# Altium schematic sheet Schematic Ouvre_Porte.SchDoc
size A4
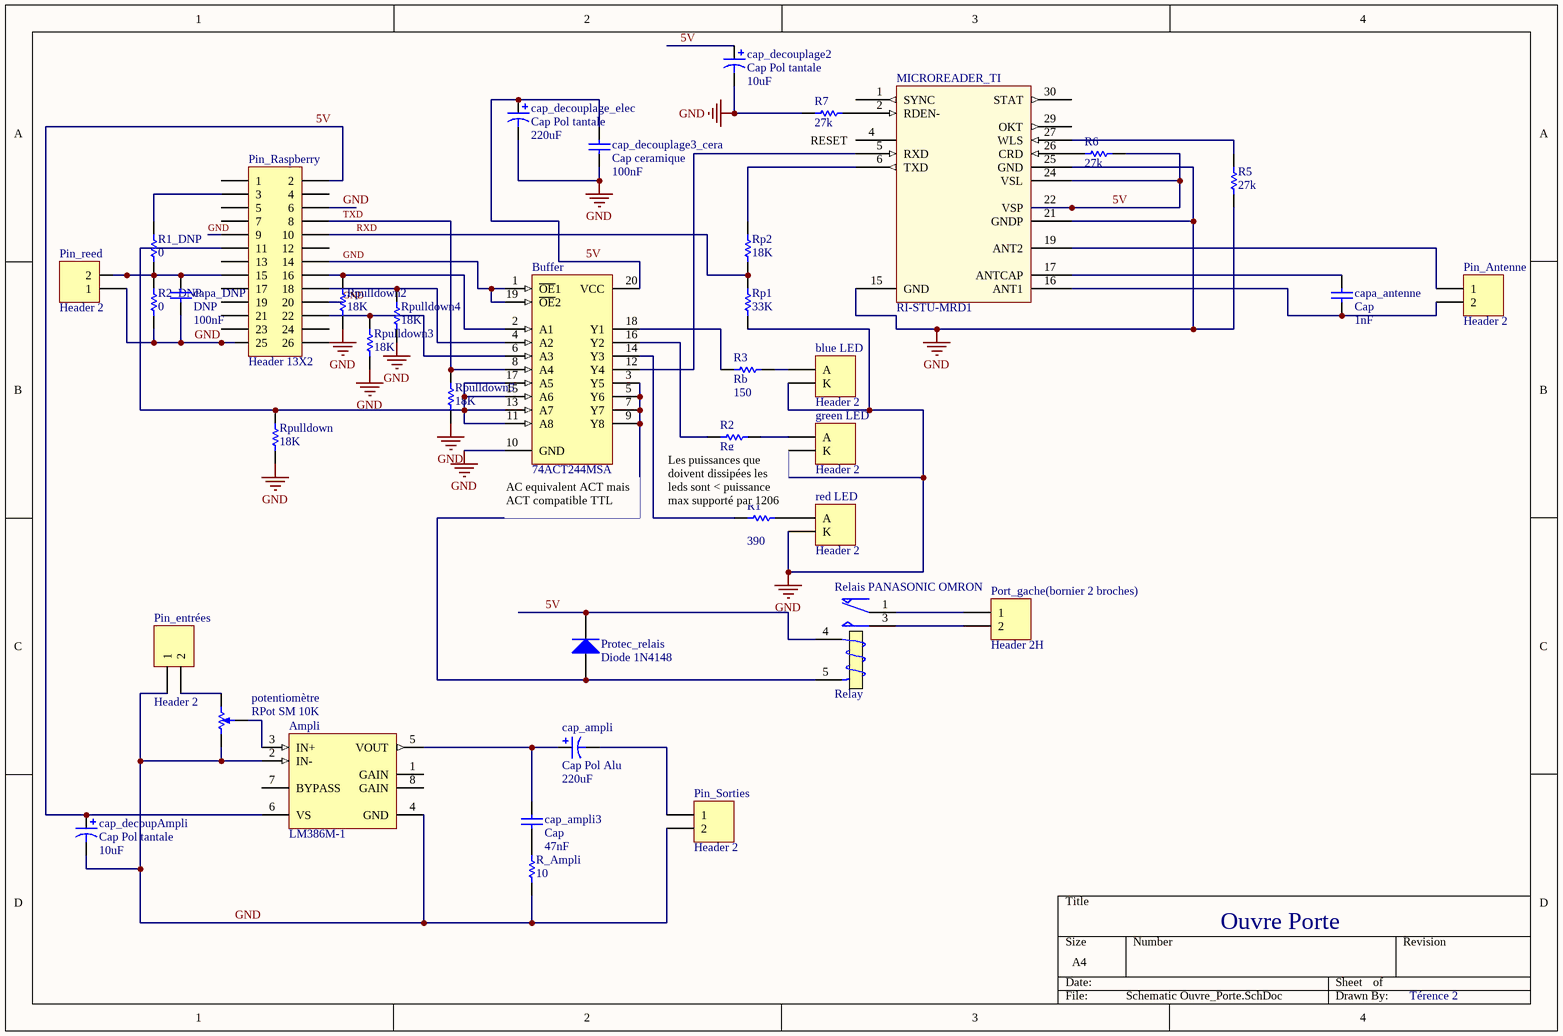
[diagram p0: Schematic Ouvre_Porte.SchDoc]

## Parts
Ampli  LM386M-1  [M08A_N]
blue_LED  Header 2  [HDR1X2]
Buffer  74ACT244MSA  [MSA20_L]
cap_ampli  Cap Pol Alu  value 220uF  [Capacitor D300]
cap_ampli3  Cap  value 47nF  [1206]
cap_decoupAmpli  Cap Pol tantale  value 10uF  [1206]
cap_decouplage2  Cap Pol tantale  value 10uF  [1206]
cap_decouplage3_cera  Cap ceramique  value 100nF  [1206]
cap_decouplage_elec  Cap Pol tantale  value 220uF  [Capacitor D300]
capa_antenne  Cap  value 1nF  [1206]
capa_DNP  DNP  value 100nF  [1206]
green_LED  Header 2  [HDR1X2]
MICROREADER_TI  RI-STU-MRD1  [DIP30]
Pin_Antenne  Header 2  [HDR1X2]
Pin_entrées  Header 2  [HDR1X2]
Pin_Raspberry  Header 13X2  [HDR2X13]
Pin_reed  Header 2  [HDR1X2]
Pin_Sorties  Header 2  [HDR1X2]
Port_gache(bornier_2_broches)  Header 2H  [2P_PCB_ScrewTerm_90S_3.81MM]
potentiomètre  RPot SM 10K  [POT4MM-2]
Protec_relais  Diode 1N4148  [1206]
R1  value 390  [8-1206]  (hidden comment: Rr)
R1_DNP  value 0  [8-1206]  (hidden comment: DNP)
R2  Rg  value 150  [8-1206]
R2_DNP  value 0  [8-1206]  (hidden comment: DNP)
R3  Rb  value 150  [8-1206]
R5  value 27k  [8-1206]  (hidden comment: Rr)
R6  value 27k  [8-1206]  (hidden comment: Rr)
R7  value 27k  [8-1206]  (hidden comment: Rr)
R_Ampli  value 10  [8-1206]  (hidden comment: Rr)
red_LED  Header 2  [HDR1X2]
Relais_PANASONIC_OMRON  Relay  [layout Relais]
Rp1  value 33K  [8-1206]
Rp2  value 18K  [8-1206]  (hidden comment: Rr)
Rpulldown  value 18K  [8-1206]
Rpulldown2  value 18K  [8-1206]
Rpulldown3  value 18K  [8-1206]
Rpulldown4  value 18K  [8-1206]
Rpulldown5  value 18K  [8-1206]

## Nets
GND: Ampli.2(IN-) Ampli.4(GND) blue_LED.2(K) Buffer.1(~{OE}1) Buffer.10(GND) Buffer.19(~{OE}2) cap_decoupAmpli.2 cap_decouplage2.2 cap_decouplage3_cera.2 cap_decouplage_elec.2 capa_DNP.2 green_LED.2(K) MICROREADER_TI.15(GND) MICROREADER_TI.21(GNDP) MICROREADER_TI.25(GND) Pin_entrées.1 Pin_Raspberry.6 Pin_Raspberry.9 Pin_Raspberry.14 Pin_Raspberry.20 Pin_Raspberry.25 Pin_reed.1 Pin_Sorties.2 potentiomètre.CCW(-) R2_DNP.1 R5.1 R7.2 R_Ampli.1 red_LED.2(K) Rp1.1 Rpulldown.1 Rpulldown2.1 Rpulldown3.1 Rpulldown4.1 Rpulldown5.1
5V: Ampli.6(VS) Buffer.20(VCC) cap_decoupAmpli.1 cap_decouplage2.1 cap_decouplage3_cera.1 cap_decouplage_elec.1 MICROREADER_TI.22(VSP) MICROREADER_TI.24(VSL) Pin_Raspberry.2 Protec_relais.2(K) R6.1 Relais_PANASONIC_OMRON.4(T1)
RXD: Pin_Raspberry.10 Rp1.2 Rp2.1
TXD: Buffer.8(A4) Pin_Raspberry.8 Rpulldown5.2
NetAmpli_3: Ampli.3(IN+) potentiomètre.W
NetAmpli_5: Ampli.5(VOUT) cap_ampli.1 cap_ampli3.2
Netblue_LED_1: blue_LED.1(A) R3.2
NetBuffer_2: Buffer.2(A1) Pin_Raspberry.16 Rpulldown2.2
NetBuffer_3: Buffer.3(Y5) Buffer.5(Y6) Buffer.7(Y7) Buffer.9(Y8) Protec_relais.1(A) Relais_PANASONIC_OMRON.5(T2)
NetBuffer_4: Buffer.4(A2) Pin_Raspberry.18 Rpulldown4.2
NetBuffer_6: Buffer.6(A3) Pin_Raspberry.22 Rpulldown3.2
NetBuffer_11: Buffer.11(A8) Buffer.13(A7) Buffer.15(A6) Buffer.17(A5) Pin_Raspberry.11 Rpulldown.2
NetBuffer_12: Buffer.12(Y4) MICROREADER_TI.5(RXD)
NetBuffer_14: Buffer.14(Y3) R1.1
NetBuffer_16: Buffer.16(Y2) R2.1
NetBuffer_18: Buffer.18(Y1) R3.1
Netcap_ampli3_1: cap_ampli3.1 R_Ampli.2
Netcap_ampli_2: cap_ampli.2 Pin_Sorties.1
Netcapa_antenne_1: capa_antenne.1 MICROREADER_TI.17(ANTCAP)
Netcapa_antenne_2: capa_antenne.2 MICROREADER_TI.16(ANT1) Pin_Antenne.2
Netcapa_DNP_1: capa_DNP.1 Pin_Raspberry.15 Pin_reed.2 R1_DNP.1 R2_DNP.2
Netgreen_LED_1: green_LED.1(A) R2.2
NetMICROREADER_TI_2: MICROREADER_TI.2(RDEN-) R7.1
NetMICROREADER_TI_6: MICROREADER_TI.6(TXD) Rp2.2
NetMICROREADER_TI_19: MICROREADER_TI.19(ANT2) Pin_Antenne.1
NetMICROREADER_TI_26: MICROREADER_TI.26(CRD) R6.2
NetMICROREADER_TI_27: MICROREADER_TI.27(WLS) R5.2
NetPin_entrées_2: Pin_entrées.2 potentiomètre.CW(+)
NetPin_Raspberry_3: Pin_Raspberry.3 R1_DNP.2
NetPort_gache(bornier_2_broches)_1: Port_gache(bornier_2_broches).1 Relais_PANASONIC_OMRON.1(COM)
NetPort_gache(bornier_2_broches)_2: Port_gache(bornier_2_broches).2 Relais_PANASONIC_OMRON.3(NO)
NetR1_2: R1.2 red_LED.1(A)

Not connected (* = marked no-connect by the designer): Ampli 1(GAIN) 7(BYPASS) 8(GAIN); MICROREADER_TI 1(SYNC) 4(RESET) 29(OKT) 30(STAT); Pin_Raspberry 1 4 5 7 12 13 17 19 21 23 24 26

## Notes on the sheet
- (near Buffer) AC equivalent ACT mais ACT compatible TTL
- Les puissances que doivent dissipées les leds sont < puissance max supporté par 1206
- Ouvre Porte
- Térence 2

## Library data of the parts
Ampli = LM386M-1: Low Voltage Audio Power Amplifier, 8-pin Narrow SOIC; Manufacturer: National Semiconductor; PackageTopMarking: NSZXTT*LM386*M-1; PowerWise: N; CompType: Audio IC; Published: 4-Dec-2008; DatasheetVersion: Aug-2000; PackageVersion: revM, May-2009; PackageReference: M08A; Publisher: Altium Limited; PackageDescription: SOIC Narrow, 4.9 x 3.9 x 1.45mm, 8 Lead, 1.27mm Pitch; Supplier 1: Farnell; Supplier Part Number 1: 9488324; PartNumber: LM386M-1; RoHS: N; PinCount: 8; Code_JEDEC: MS-012-AA; Code_IPC: SOIC127P600-8; ComponentLink1Description: LM386 Datasheet; ComponentLink1URL: http://www.national.com/ds/LM/LM386.pdf; ComponentLink2Description: LM386 Web Page; ComponentLink2URL: http://www.national.com/pf/LM/LM386.html; ComponentLink3Description: M08A Package Page; ComponentLink3URL: http://www.national.com/packaging/folders/m08a.html
blue_LED green_LED Pin_Antenne Pin_entrées Pin_reed Pin_Sorties red_LED = Header 2: Header, 2-Pin; LatestRevisionDate: 17-Jul-2002; LatestRevisionNote: Re-released for DXP Platform.; Publisher: Altium Limited
Buffer = 74ACT244MSA: Octal Buffer/Line Driver with 3-State Output; Published: 17-Jul-2002; LatestRevisionDate: 29-May-2009; LatestRevisionNote: IPC-7351 Footprint Added.; DatasheetVersion: Nov-1999; PackageVersion: 2000; PackageReference: MSA20; Publisher: Altium Limited; PackageDescription: 20-Pin Small Outline Package 0.65 mm Pitch; ComponentLink1Description: Manufacturer Link; ComponentLink1URL: http://www.fairchildsemi.com/; ComponentLink2Description: Datasheet; ComponentLink2URL: http://www.fairchildsemi.com/ds/74%2F74AC244.pdf
cap_ampli cap_decoupAmpli cap_decouplage2 cap_decouplage_elec = Cap Pol1: Polarized Capacitor (Radial); Published: 8-Jun-2000; LatestRevisionDate: 17-Jul-2002; LatestRevisionNote: Re-released for DXP Platform.; PackageReference: RB7.6-15; Publisher: Altium Limited; PackageDescription: Polarized Capacitor (Radial); 2 Leads
cap_ampli3 cap_decouplage3_cera capa_antenne capa_DNP = Cap: Capacitor; Published: 8-Jun-2000; LatestRevisionDate: 17-Jul-2002; LatestRevisionNote: Re-released for DXP Platform.; PackageReference: RAD-0.3; Publisher: Altium Limited; PackageDescription: Radial Cap, Thru-Hole; 2 Leads; 0.3 in Pin Spacing
MICROREADER_TI = Component_1
Pin_Raspberry = Header 13X2: Header, 13-Pin, Dual row; LatestRevisionDate: 17-Jul-2002; LatestRevisionNote: Re-released for DXP Platform.; Publisher: Altium Limited
Port_gache(bornier_2_broches) = Header 2H: Header, 2-Pin, Right Angle; LatestRevisionDate: 17-Jul-2002; LatestRevisionNote: Re-released for DXP Platform.; Publisher: Altium Limited
potentiomètre = RPot SM: Square Trimming Potentiometer; Published: 17-Dec-2003; DatasheetVersion: Oct-2003; PackageReference: POT4MM-2; Publisher: Altium Limited; PackageDescription: Square Trimming Potentiometer; ComponentLink1Description: Manufacturer Link; ComponentLink1URL: http://bourns.com/2/search.html
Protec_relais = Diode 1N4148: High Conductance Fast Diode; Published: 8-Jun-2000; LatestRevisionDate: 17-Jul-2002; LatestRevisionNote: Re-released for DXP Platform.; DatasheetVersion: 1997; PackageReference: DO-35; Publisher: Altium Limited; PackageDescription: Diode, Axial; Body 3.8 x 1.9 mm (LxDia. max), Lead Dia. 0.53 mm (max); Code_JEDEC: DO-204-AH; ComponentLink1Description: Manufacturer Link; ComponentLink1URL: http://www.fairchildsemi.com/; ComponentLink2Description: Datasheet; ComponentLink2URL: http://www.fairchildsemi.com/ds/1N%2F1N4148.pdf
R1 R1_DNP R2 R2_DNP R3 R5-R7 R_Ampli Rp1 Rp2 Rpulldown Rpulldown2-Rpulldown5 = Res1: Resistor; Published: 8-Jun-2000; LatestRevisionDate: 17-Jul-2002; LatestRevisionNote: Re-released for DXP Platform.; PackageReference: AXIAL-0.3; Publisher: Altium Limited; PackageDescription: Axial Device, Thru-Hole; 2 Leads; 0.3 in Pin Spacing
Relais_PANASONIC_OMRON = Relay: SPDT Relay; Published: 8-Jun-2000; LatestRevisionDate: 17-Jul-2002; LatestRevisionNote: Re-released for DXP Platform.; PackageReference: MODULE5B; Publisher: Altium Limited